# Altium schematic sheet AUDIO.SchDoc
size A4
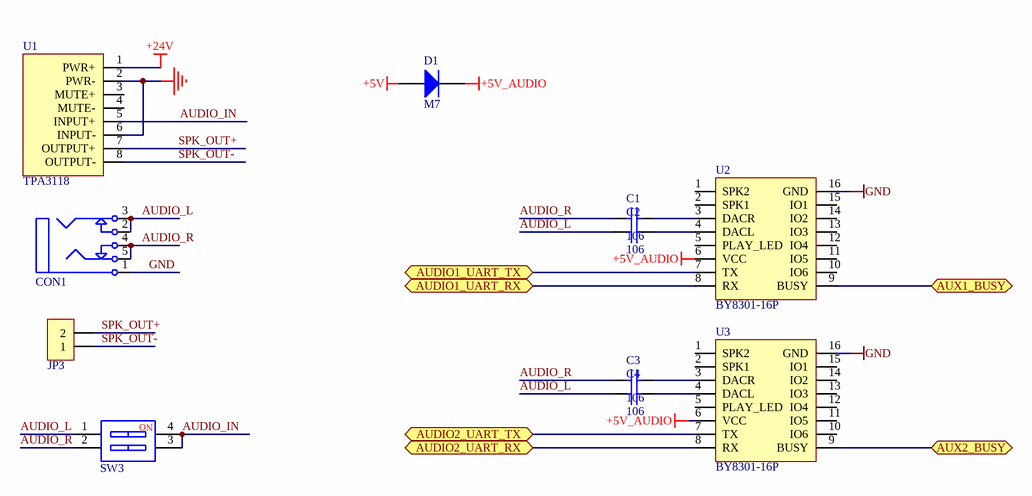
[diagram p0: AUDIO.SchDoc]

## Parts
C1  106  [C 1206]
C2  106  [C 1206]
C3  106  [C 1206]
C4  106  [C 1206]
CON1  PJ325_BK  [PJ325_PK]  (value not drawn)
D1  M7  [SMA]
JP3  AUX  [557-2X1]  (value not drawn)
SW3  CSW-2P  [CSW1.27 SMD-2P]  (value not drawn)
U1  TPA3118  [TPA3118-L]
U2  BY8301-16P  [BY8301-16P]
U3  BY8301-16P  [BY8301-16P]

## Ports
AUDIO1_UART_RX (bidir), AUDIO1_UART_TX (bidir), AUDIO2_UART_RX (bidir), AUDIO2_UART_TX (bidir), AUX1_BUSY, AUX2_BUSY

## Nets
+5V: D1.1
+5V_AUDIO: D1.2 U2.6(VCC) U3.6(VCC)
+24V: U1.1(PWR+)
GND: CON1.1 U1.2(PWR-) U1.6(INPUT-) U2.16(GND) U3.16(GND)
AUDIO1_UART_RX: U2.8(RX) ; port AUDIO1_UART_RX
AUDIO1_UART_TX: U2.7(TX) ; port AUDIO1_UART_TX
AUDIO2_UART_RX: U3.8(RX) ; port AUDIO2_UART_RX
AUDIO2_UART_TX: U3.7(TX) ; port AUDIO2_UART_TX
AUDIO_IN: SW3.3 SW3.4 U1.5(INPUT+)
AUDIO_L: C2.1 C4.1 CON1.2 CON1.3 SW3.1
AUDIO_R: C1.1 C3.1 CON1.4 CON1.5 SW3.2
AUX1_BUSY: U2.9(BUSY) ; port AUX1_BUSY
AUX2_BUSY: U3.9(BUSY) ; port AUX2_BUSY
SPK_OUT+: JP3.2 U1.7(OUTPUT+)
SPK_OUT-: JP3.1 U1.8(OUTPUT-)
NetC1_2: C1.2 U2.3(DACR)
NetC2_2: C2.2 U2.4(DACL)
NetC3_2: C3.2 U3.3(DACR)
NetC4_2: C4.2 U3.4(DACL)

Not connected (* = marked no-connect by the designer): U1 3(MUTE+) 4(MUTE-); U2 1(SPK2) 2(SPK1) 5(PLAY_LED) 10(IO6) 11(IO5) 12(IO4) 13(IO3) 14(IO2) 15(IO1); U3 1(SPK2) 2(SPK1) 5(PLAY_LED) 10(IO6) 11(IO5) 12(IO4) 13(IO3) 14(IO2) 15(IO1)

## Notes on the sheet
- 设 计
- 制 图
- 审 核
- 类 别
- 签  字
- 日 期
- 产 品
- 名 称
- 零 件
- 板  名
- 数  量
- 共  张
- 第  张
- 批 准
- 文件编号
- 沈阳市创奇游乐设备有限公司
- (in symbol CSW-2P) NO

## Library data of the parts
C1-C4 = Cap: Capacitor; Published: 8-Jun-2000; LatestRevisionDate: 17-Jul-2002; LatestRevisionNote: Re-released for DXP Platform.; Publisher: Altium Limited
CON1 = PJ325: 3.5mm耳机插座; BOM名称: 耳机插座; 版权归属: 源创客; 学习资源: www.ooocke.com
D1 = Diode
JP3 = Header 2: 2P接插件; 版权归属: 源创客; BOM名称: 2P接插件; 学习资源: www.ooocke.com
SW3 = CSW-2P: 2路编码开关; 版权归属: 源创客; BOM名称: 2路编码开关; 学习资源: www.ooocke.com
U1 = TPA3118: TPA3118单声道功放板
U2 U3 = BY8301-16P: BY8001-16P语音模块